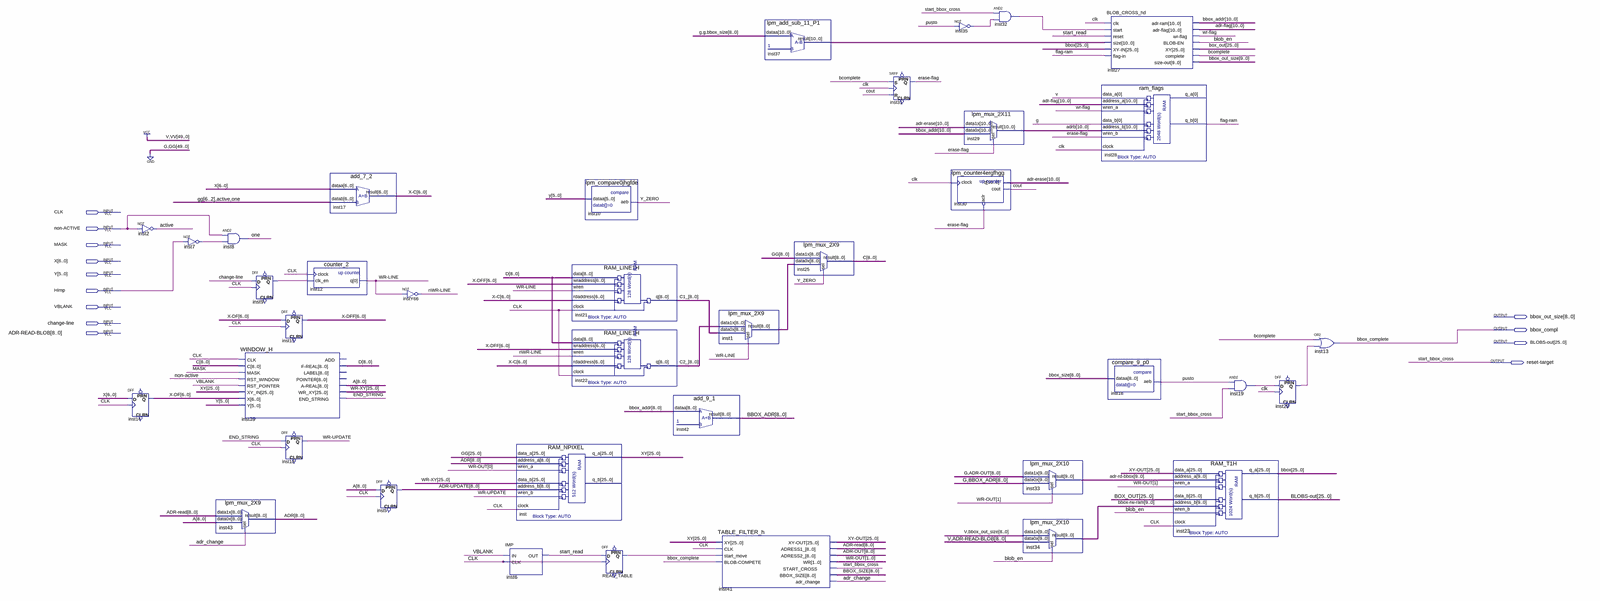
[diagram p0: schematic sheet, whole]
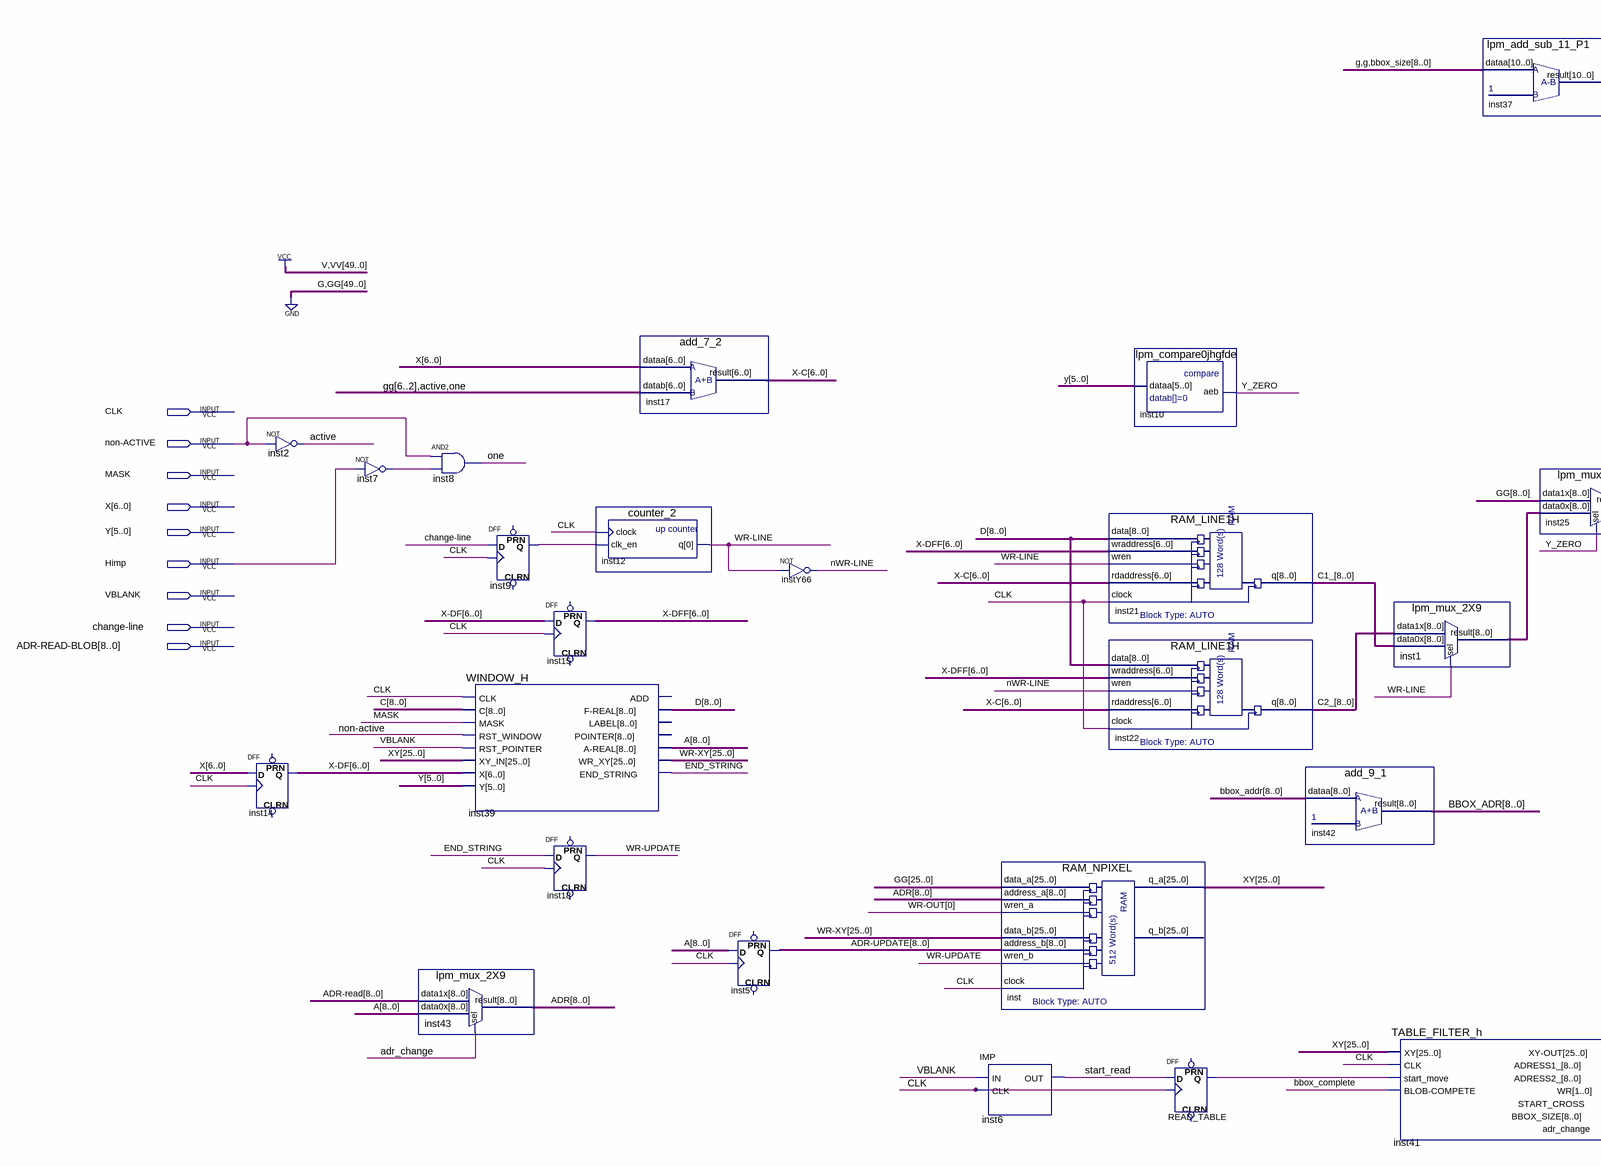
[diagram p1: schematic sheet, left part]
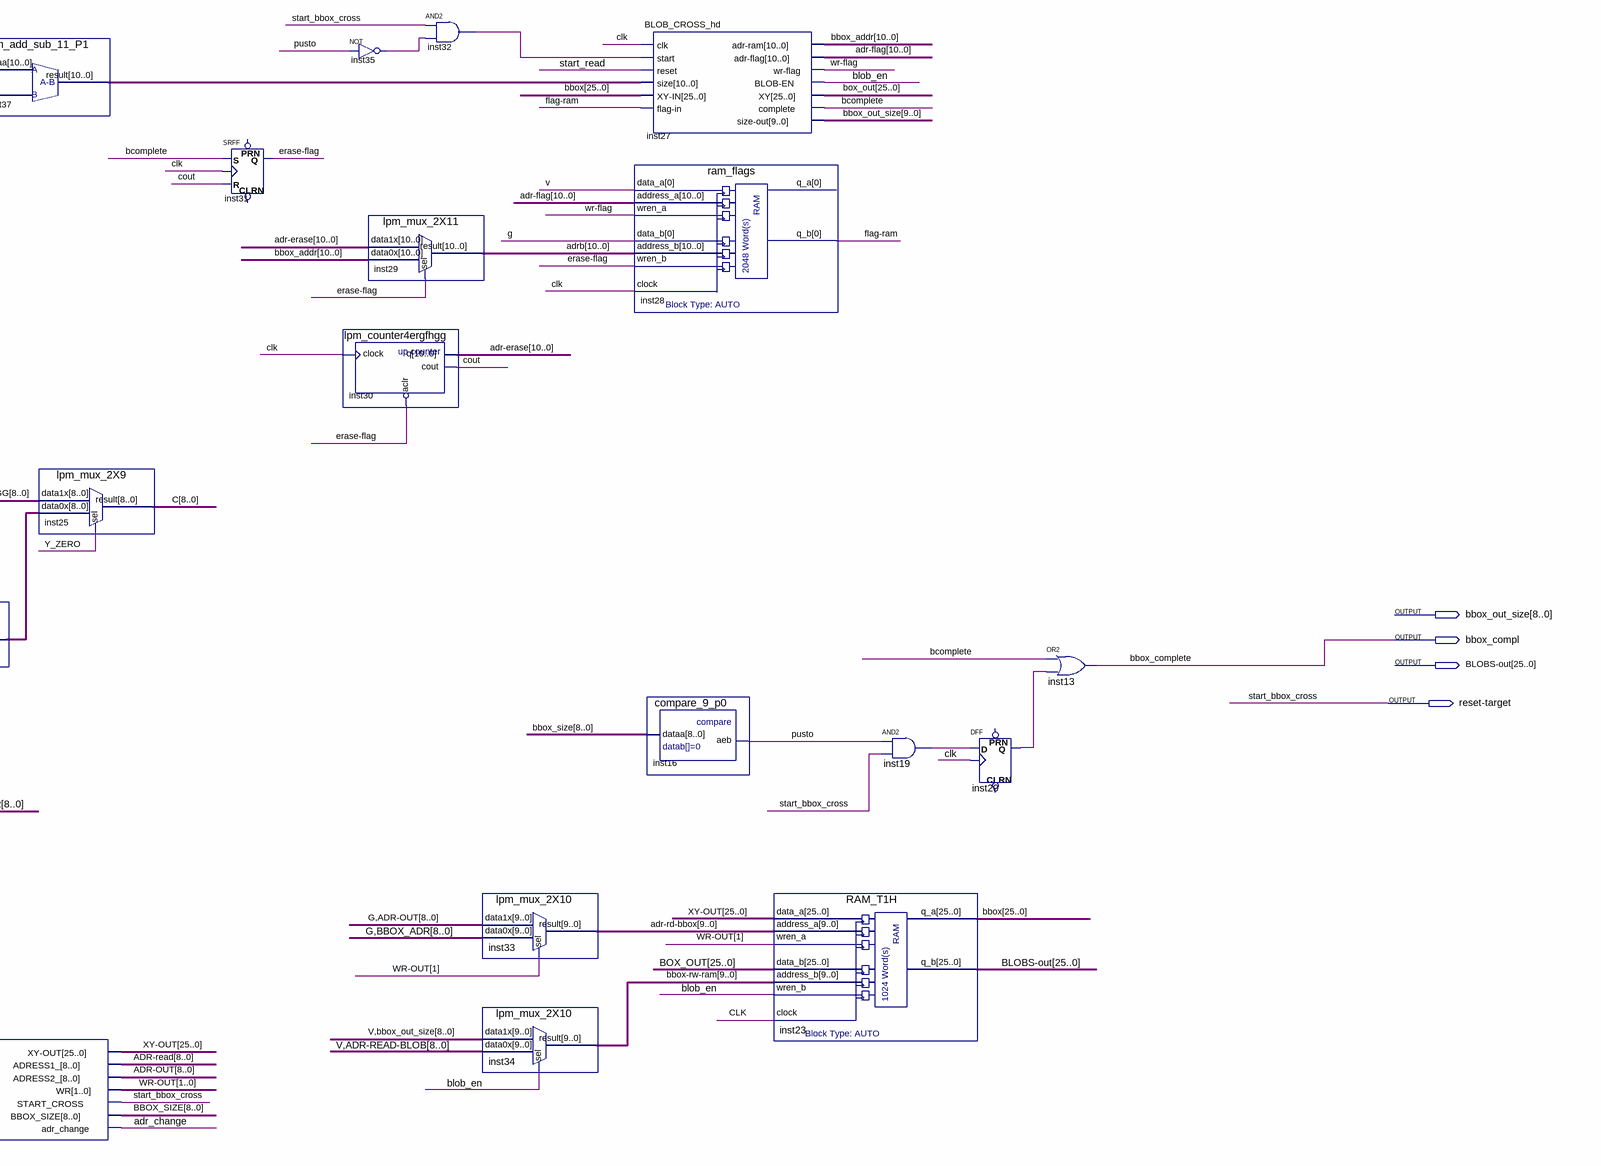
[diagram p2: schematic sheet, right part]
// Quartus schematic HTPA-BLOB.bdf as structural Verilog: 38 symbols, 13 pins
module \HTPA-BLOB  (
  input  CLK,
  input  \non-ACTIVE ,
  input  MASK,
  input  [6:0] X,
  input  [5:0] Y,
  input  Himp,
  input  VBLANK,
  input  \change-line ,
  input  [8:0] \ADR-READ-BLOB ,
  output [9:0] bbox_out_size,
  output bbox_compl,
  output [25:0] \BLOBS-out ,
  output \reset-target 
);

  wire active, adr_change, bcomplete, blob_en, cout, END_STRING, \erase-flag , \flag-ram , inst7_out,
       inst9_q, inst19_out, inst20_q, inst32_out, inst35_out, \nWR-LINE , one, pusto, READ_TABLE_q,
       start_read, \wr-flag , \WR-LINE , \WR-UPDATE , Y_ZERO;
  wire [1:0] \WR-OUT ;
  wire [6:0] \X-C , \X-DF , \X-DFF ;
  wire [8:0] A, ADR, \ADR-OUT , \ADR-read , \ADR-UPDATE , BBOX_ADR, bbox_size, C, C1_, C2_, D, inst1_result;
  wire [9:0] \adr-rd-bbox , \bbox-rw-ram ;
  wire [10:0] \adr-erase , \adr-flag , adrb, bbox_addr, inst37_result;
  wire [25:0] bbox, BOX_OUT, \WR-XY , XY, \XY-OUT ;

  not inst2 (active, \non-ACTIVE );
  DFF inst14[6:0] (.CLK(CLK), .D(X), .Q(\X-DF ));  // open: CLRN, PRN
  not inst7 (inst7_out, Himp);
  and inst8 (one, \non-ACTIVE , inst7_out);
  lpm_mux_2X9 inst43 (.data1x(\ADR-read ), .data0x(A), .sel(adr_change), .result(ADR));
  WINDOW_H inst39 (
    .CLK(CLK), .C(C), .MASK(MASK), .RST_WINDOW(\non-ACTIVE ), .RST_POINTER(VBLANK), .XY_IN(XY), .X(\X-DF ),
    .Y(Y), .\F-REAL (D), .\A-REAL (A), .WR_XY(\WR-XY ), .END_STRING(END_STRING));  // open: ADD, LABEL, POINTER
  DFF inst9 (.CLK(CLK), .D(\change-line ), .Q(inst9_q));  // open: CLRN, PRN
  DFF inst15[6:0] (.CLK(CLK), .D(\X-DF ), .Q(\X-DFF ));  // open: CLRN, PRN
  DFF inst18 (.CLK(CLK), .D(END_STRING), .Q(\WR-UPDATE ));  // open: CLRN, PRN
  counter_2 inst12 (.clock(CLK), .clk_en(inst9_q), .q(\WR-LINE ));
  add_7_2 inst17 (.dataa(X), .datab({{5{1'b0}}, active, one}), .result(\X-C ));
  DFF inst5[8:0] (.CLK(CLK), .D(A), .Q(\ADR-UPDATE ));  // open: CLRN, PRN
  not instY66 (\nWR-LINE , \WR-LINE );
  IMP inst6 (.IN(VBLANK), .CLK(CLK), .OUT(start_read));
  RAM_NPIXEL inst (
    .data_a({26{1'b0}}), .address_a(ADR), .wren_a(\WR-OUT [0]), .data_b(\WR-XY ), .address_b(\ADR-UPDATE ),
    .wren_b(\WR-UPDATE ), .clock(CLK), .q_a(XY));  // open: q_b
  lpm_compare0jhgfde inst10 (.dataa(Y), .aeb(Y_ZERO));
  RAM_LINE1H inst21 (.data(D), .wraddress(\X-DFF ), .wren(\WR-LINE ), .rdaddress(\X-C ), .clock(CLK), .q(C1_));
  RAM_LINE1H inst22 (.data(D), .wraddress(\X-DFF ), .wren(\nWR-LINE ), .rdaddress(\X-C ), .clock(CLK), .q(C2_));
  DFF READ_TABLE (.CLK(CLK), .D(start_read), .Q(READ_TABLE_q));  // open: CLRN, PRN
  add_9_1 inst42 (.dataa(bbox_addr[8:0]), .result(BBOX_ADR));
  lpm_mux_2X9 inst1 (.data1x(C2_), .data0x(C1_), .sel(\WR-LINE ), .result(inst1_result));
  TABLE_FILTER_h inst41 (
    .XY(XY), .CLK(CLK), .start_move(READ_TABLE_q), .\BLOB-COMPETE (bbox_compl), .\XY-OUT (\XY-OUT ),
    .ADRESS1_(\ADR-read ), .ADRESS2_(\ADR-OUT ), .WR(\WR-OUT ), .START_CROSS(\reset-target ),
    .BBOX_SIZE(bbox_size), .adr_change(adr_change));
  lpm_add_sub_11_P1 inst37 (.dataa({2'b00, bbox_size}), .result(inst37_result));
  lpm_mux_2X9 inst25 (.data1x({9{1'b0}}), .data0x(inst1_result), .sel(Y_ZERO), .result(C));
  SRFF inst31 (.S(bcomplete), .R(cout), .CLK(CLK), .Q(\erase-flag ));  // open: PRN, CLRN
  not inst35 (inst35_out, pusto);
  lpm_counter4ergfhgg inst30 (.aclr(~\erase-flag ), .clock(CLK), .cout(cout), .q(\adr-erase ));
  lpm_mux_2X11 inst29 (.data1x(\adr-erase ), .data0x(bbox_addr), .sel(\erase-flag ), .result(adrb));
  and inst32 (inst32_out, \reset-target , inst35_out);
  lpm_mux_2X10 inst33 (
    .data1x({1'b0, \ADR-OUT }), .data0x({1'b0, BBOX_ADR}), .sel(\WR-OUT [1]), .result(\adr-rd-bbox ));
  lpm_mux_2X10 inst34 (
    .data1x({1'b1, bbox_out_size[8:0]}), .data0x({1'b1, \ADR-READ-BLOB }), .sel(blob_en),
    .result(\bbox-rw-ram ));
  BLOB_CROSS_hd inst27 (
    .clk(CLK), .start(inst32_out), .reset(start_read), .size(inst37_result), .\XY-IN (bbox),
    .\flag-in (\flag-ram ), .\adr-ram (bbox_addr), .\adr-flag (\adr-flag ), .\wr-flag (\wr-flag ),
    .\BLOB-EN (blob_en), .XY(BOX_OUT), .complete(bcomplete), .\size-out (bbox_out_size));
  ram_flags inst28 (
    .data_a(1'b1), .address_a(\adr-flag ), .wren_a(\wr-flag ), .data_b(1'b0), .address_b(adrb),
    .wren_b(\erase-flag ), .clock(CLK), .q_b(\flag-ram ));  // open: q_a
  compare_9_p0 inst16 (.dataa(bbox_size), .aeb(pusto));
  RAM_T1H inst23 (
    .data_a(\XY-OUT ), .address_a(\adr-rd-bbox ), .wren_a(\WR-OUT [1]), .data_b(BOX_OUT),
    .address_b(\bbox-rw-ram ), .wren_b(blob_en), .clock(CLK), .q_a(bbox), .q_b(\BLOBS-out ));
  and inst19 (inst19_out, pusto, \reset-target );
  DFF inst20 (.CLK(CLK), .D(inst19_out), .Q(inst20_q));  // open: CLRN, PRN
  or inst13 (bbox_compl, bcomplete, inst20_q);

  // Other names for the same wires on the sheet: bbox_complete = bbox_compl; start_bbox_cross = \reset-target 
endmodule
